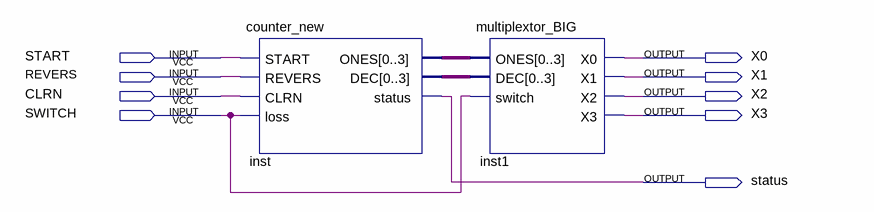
[diagram p0: schematic sheet]
// Quartus schematic counter_new_with_multiplexer_BIG.bdf as structural Verilog: 2 symbols, 9 pins
module counter_new_with_multiplexer_BIG (
  input  START,
  input  REVERS,
  input  CLRN,
  input  SWITCH,
  output X0,
  output X1,
  output X2,
  output X3,
  output status
);

  wire [3:0] inst_dec, inst_ones;

  counter_new inst (
    .START(START), .REVERS(REVERS), .CLRN(CLRN), .loss(SWITCH), .ONES(inst_ones), .DEC(inst_dec),
    .status(status));
  multiplextor_BIG inst1 (.ONES(inst_ones), .DEC(inst_dec), .switch(SWITCH), .X0(X0), .X1(X1), .X2(X2), .X3(X3));
endmodule
